# EAGLE design CAN Transceiver 3.5 rev1 (EAGLE 9.6.2)
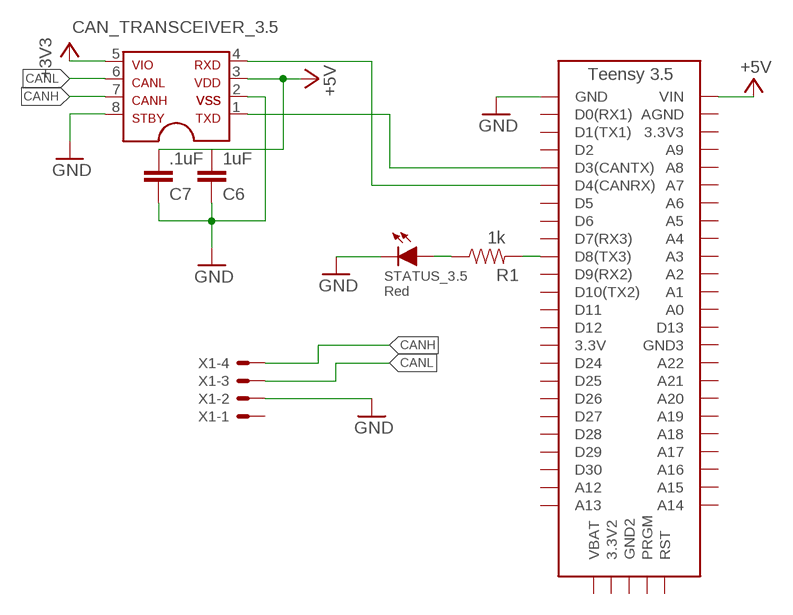
[diagram p0: schematic, sheet 1]

## Parts
C6  1uF  CAP0603-CAP  [0603-CAP]
C7  .1uF  CAP0603-CAP  [0603-CAP]
CAN_TRANSCEIVER_3.5  MCP2562SOIC-08  [SOIC-08]
R1  1k  RESISTOR0603-RES  [0603-RES]
STATUS_3.5  Red  LED-0805  [LED-805]
U$1  TEENSY_3.5_EXT_RTC  [TEENSY_3.5_EXT_RTC]
X1  CONNECTOR-4NANO-FIT_RIGHT_ANGLE-4-SURFACE  [NANO-FIT_RIGHT_ANGLE-4-SURFACE]

## Nets
+3V3: CAN_TRANSCEIVER_3.5.5
+5V: C6.1 C7.1 CAN_TRANSCEIVER_3.5.3
CANH: CAN_TRANSCEIVER_3.5.7 X1.4
CANL: CAN_TRANSCEIVER_3.5.6 X1.3
GND: C6.2 C7.2 CAN_TRANSCEIVER_3.5.2 CAN_TRANSCEIVER_3.5.8 STATUS_3.5.C U$1.GND X1.2
N$1: CAN_TRANSCEIVER_3.5.4 U$1.D4(CANRX)
N$2: CAN_TRANSCEIVER_3.5.1 U$1.D3(CANTX)
N$4: U$1.VIN ; supply symbol labelled +5V
N$5: R1.1 STATUS_3.5.A
N$9: R1.2 U$1.D8(TX3)
Unconnected: U$1.3.3V U$1.3.3V2 U$1.3.3V3 U$1.A0 U$1.A1 U$1.A2 U$1.A3 U$1.A4 U$1.A5 U$1.A6 U$1.A7 U$1.A8 U$1.A9 U$1.A12 U$1.A13 U$1.A14 U$1.A15 U$1.A16 U$1.A17 U$1.A18 U$1.A19 U$1.A20 U$1.A21 U$1.A22 U$1.AGND U$1.D0(RX1) U$1.D1(TX1) U$1.D2 U$1.D5 U$1.D6 U$1.D7(RX3) U$1.D9(RX2) U$1.D10(TX2) U$1.D11 U$1.D12 U$1.D13 U$1.D24 U$1.D25 U$1.D26 U$1.D27 U$1.D28 U$1.D29 U$1.D30 U$1.GND2 U$1.GND3 U$1.PRGM U$1.RST U$1.VBAT X1.1

## Library data of the parts
C6 C7 = HyTechDevices:CAP: Capacitor Standard 0603 ceramic capacitor, and 0.1" leaded capacitor.
CAN_TRANSCEIVER_3.5 = HyTechDevices:MCP2562: MCP2562 High-speed CAN Transceiver Datatsheet <http://ww1.microchip.com/downloads/en/devicedoc/20005167c.pdf>
R1 = HyTechDevices:RESISTOR: Resistor Basic schematic elements and footprints for 0603, 1206, and PTH resistors.
STATUS_3.5 = HyTechDevices:LED: Light Emitting Diode (LED) Source: Dangerous Prototypes Eagle Library <https://github.com/DangerousPrototypes/Eagle_Part_Library>
U$1 = HyTechDevices:TEENSY_3.5_EXT_RTC: Extended version of the Teensy 3.5 board that only uses the 2 main rows of pins, plus the perpendicular row with VBat.
X1 = HyTechDevices:CONNECTOR-4: Mini-Fit Junior connector 4 pole Source: http://www.molex.com

## Board
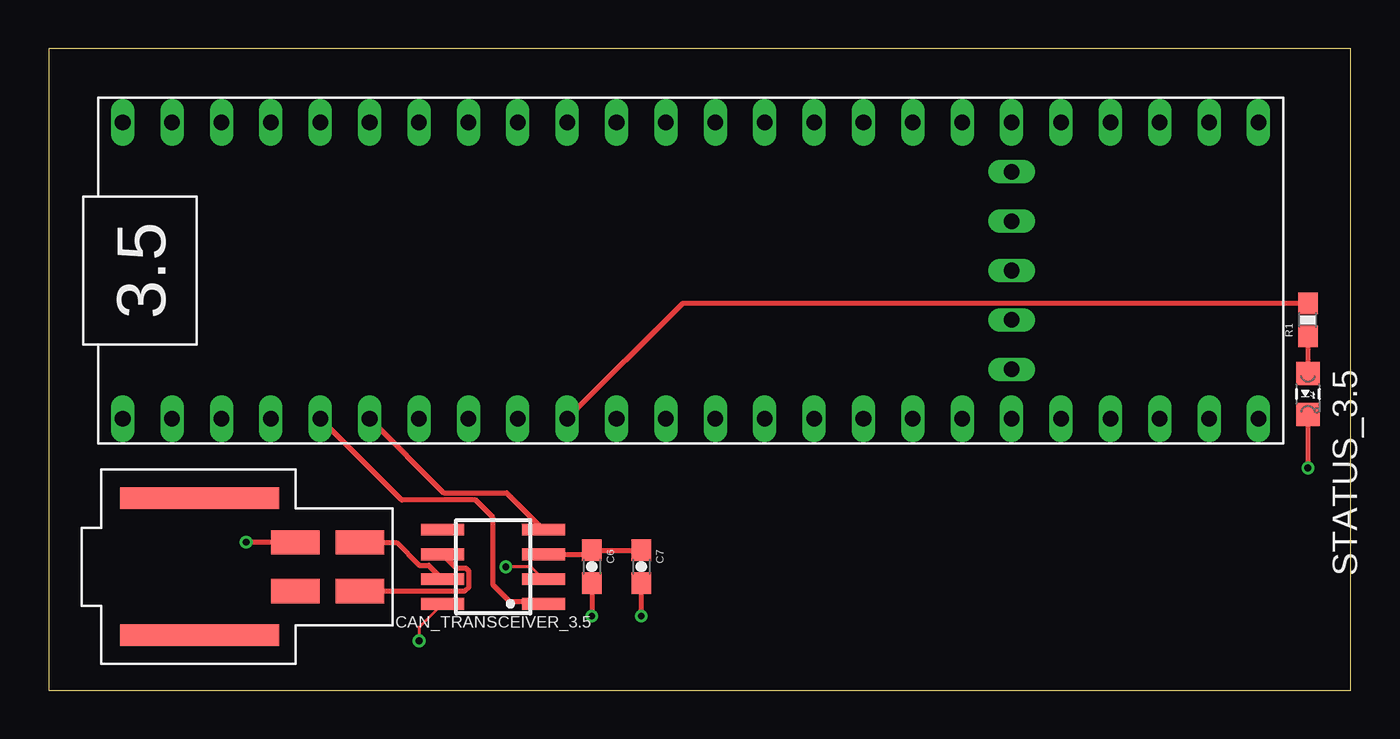
[diagram p1: board, top side]
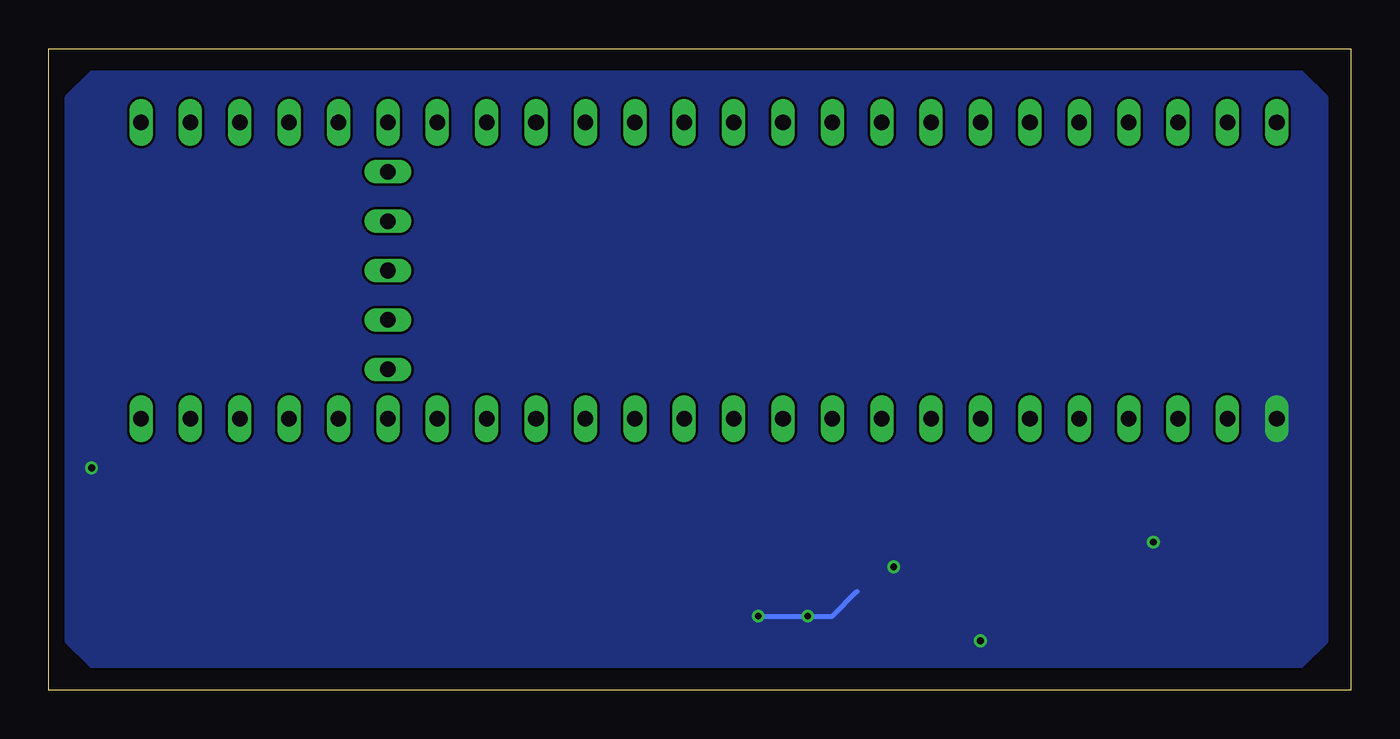
[diagram p2: board, bottom side, seen from below]

Size 66.98 x 33.01 mm. Coordinates in mm from the lower left corner, seen from the top.
Outline: 0,0 66.98,0 66.98,33.01 0,33.01 0,0
Copper layers (1*16): Top 0.035mm / dielectric 1.53mm / Bottom 0.035mm
Design rules "JLCPCB (2 Layer)": minimum track width 5mil, minimum drill 0.3mm, track to track 5mil, track to pad 5mil, pad to pad 5mil, via to via 20mil, smd to smd 5mil, copper to edge 0.2mm, drill to drill 21mil, minimum pad ring 6mil, minimum via ring 6mil, stop-mask expansion 6mil, vias tented up to drill 30mil, thermal gap 10mil

### Footprints (pad centres in the part's own frame; a part is rotated, then mirrored left to right if it is on the bottom)
0603-CAP = smd 1.1 x 1: 1 -0.85,0; 2 0.85,0
SOIC-08 = smd 0.6 x 2.2: 1 -1.905,-2.6; 2 -0.635,-2.6; 3 0.635,-2.6; 4 1.905,-2.6; 5 1.905,2.6; 6 0.635,2.6; 7 -0.635,2.6; 8 -1.905,2.6
0603-RES = smd 1.1 x 1: 1 -0.85,0; 2 0.85,0
LED-805 = smd 1.2 x 1.2: A 0,-1.05; C 0,1.05
TEENSY_3.5_EXT_RTC = drill 0.8 long: 3.3V 1.27,24.13; 3.3V2 6.35,13.97; 3.3V3 16.51,54.61; A0 16.51,29.21; A1 16.51,31.75; A2 16.51,34.29; A3 16.51,36.83; A4 16.51,39.37; A5 16.51,41.91; A6 16.51,44.45; A7 16.51,46.99; A8 16.51,49.53; A9 16.51,52.07; A12 1.27,3.81; A13 1.27,1.27; A14 16.51,1.27; A15 16.51,3.81; A16 16.51,6.35; A17 16.51,8.89; A18 16.51,11.43; A19 16.51,13.97; A20 16.51,16.51; A21 16.51,19.05; A22 16.51,21.59; AGND 16.51,57.15; D0(RX1) 1.27,57.15; D1(TX1) 1.27,54.61; D2 1.27,52.07; D3(CANTX) 1.27,49.53; D4(CANRX) 1.27,46.99; D5 1.27,44.45; D6 1.27,41.91; D7(RX3) 1.27,39.37; D8(TX3) 1.27,36.83; D9(RX2) 1.27,34.29; D10(TX2) 1.27,31.75; D11 1.27,29.21; D12 1.27,26.67; D13 16.51,26.67; D24 1.27,21.59; D25 1.27,19.05; D26 1.27,16.51; D27 1.27,13.97; D28 1.27,11.43; D29 1.27,8.89; D30 1.27,6.35; GND 1.27,59.69; GND2 8.89,13.97; GND3 16.51,24.13; PRGM 11.43,13.97; RST 13.97,13.97; VBAT 3.81,13.97; VIN 16.51,59.69
NANO-FIT_RIGHT_ANGLE-4-SURFACE = smd 1.24 x 2.5: 1 1.25,0; 2 -1.25,0; 3 1.25,3.3; 4 -1.25,3.3 | smd 1.1 x 8.2: P$5 -3.52,-4.93; P$6 3.52,-4.93

### Placement (x,y rotation side)
C6  27.94,6.35 270 top
C7  30.48,6.35 270 top
CAN_TRANSCEIVER_3.5  22.86,6.35 90 top
R1  64.77,19.05 90 top
STATUS_3.5  64.77,15.24 180 top
U$1  63.5,12.7 90 top
X1  12.7,6.35 270 top

### Tracks (layer width: path | path; a pad name or v marks a point on that pad's centre or on a via)
+5V
  Top 0.254: CAN_TRANSCEIVER_3.5.3 27.73,6.99 C6.1 C7.1
CANH
  Top 0.254: CAN_TRANSCEIVER_3.5.7 19.54,6.43 19.05,6.43 17.89,7.6 X1.4
CANL
  Top 0.254: CAN_TRANSCEIVER_3.5.6 20.98,6.27 21.46,6.27 21.61,6.12 21.61,5.31 21.4,5.1 X1.3
GND  (via drill 0.35)
  Top 0.152: CAN_TRANSCEIVER_3.5.2 24.82,6.35 v23.52,6.35 | CAN_TRANSCEIVER_3.5.8 19.05,3.23 v19.05,2.54
  Top 0.254: STATUS_3.5.C v64.77,11.43 | X1.2 10.18,7.6 v10.16,7.62 | C6.2 v27.94,3.81 | C7.2 v30.48,3.81 | CAN_TRANSCEIVER_3.5.8 19.68,4.45
  Bottom 0.254: v30.48,3.81 26.67,3.81 25.4,5.08
  pour Bottom (no thermals): 2.54,31.75 64.77,31.75 66.04,30.48 66.04,2.54 64.77,1.27 2.54,1.27 1.27,2.54 1.27,30.48
N$1
  Top 0.254: U$1.D4(CANRX) 20.32,10.16 23.55,10.16 CAN_TRANSCEIVER_3.5.4
N$2
  Top 0.254: CAN_TRANSCEIVER_3.5.1 25.35,4.55 23.73,4.55 22.86,5.42 22.86,8.89 21.97,9.78 18.16,9.78 U$1.D3(CANTX)
N$5
  Top 0.254: R1.1 STATUS_3.5.A
N$9
  Top 0.254: R1.2 50.49,19.9 50.48,19.9 32.6,19.9 U$1.D8(TX3)